# EAGLE schematic debounce_hw (EAGLE 6.0)
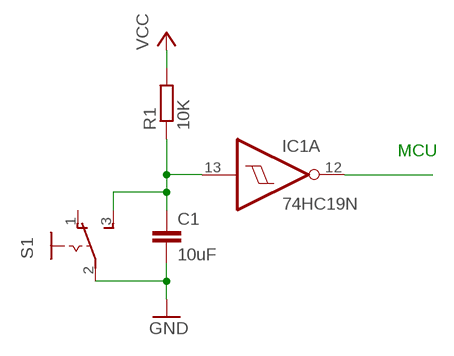
[diagram p0: schematic, sheet 1]

## Parts
C1  10uF  C-EU050-035X075  [C050-035X075]
IC1  74HC19N  [DIL14]
R1  10K  R-EU_0411/15  [0411/15]
S1  M251  [M251]

## Nets
GND: C1.2 S1.2(P)
N$1: C1.1 IC1.13(A:I) R1.1 S1.3(S)
N$3: IC1.12(A:O)
VCC: R1.2
Unconnected: IC1.1(D:I) IC1.2(D:O) IC1.3(E:I) IC1.4(E:O) IC1.5(F:I) IC1.6(F:O) IC1.8(C:O) IC1.9(C:I) IC1.10(B:O) IC1.11(B:I) S1.1(O)

## Notes on the sheet
- MCU

## Power pins joined to a net without a drawn wire
GND: IC1.7(P:GND)
VCC: IC1.14(P:VCC)

## Library data of the parts
C1 = rcl:C-EU: CAPACITOR, European symbol
IC1 = 74xx-eu:74*19: Hex schmitt trigger INVERTER
R1 = rcl:R-EU_: RESISTOR, European symbol
S1 = switch:M251: SLIDING SWITCH Mors, distributor Buerklin, 11G702